# EasyEDA schematic Ranger_PCB.json

## Sheets
1 ESP32: TITLE: Sheet_1; REV: 1.0; Date: 2026-08-03; Sheet: 1/1; Company: Your Company
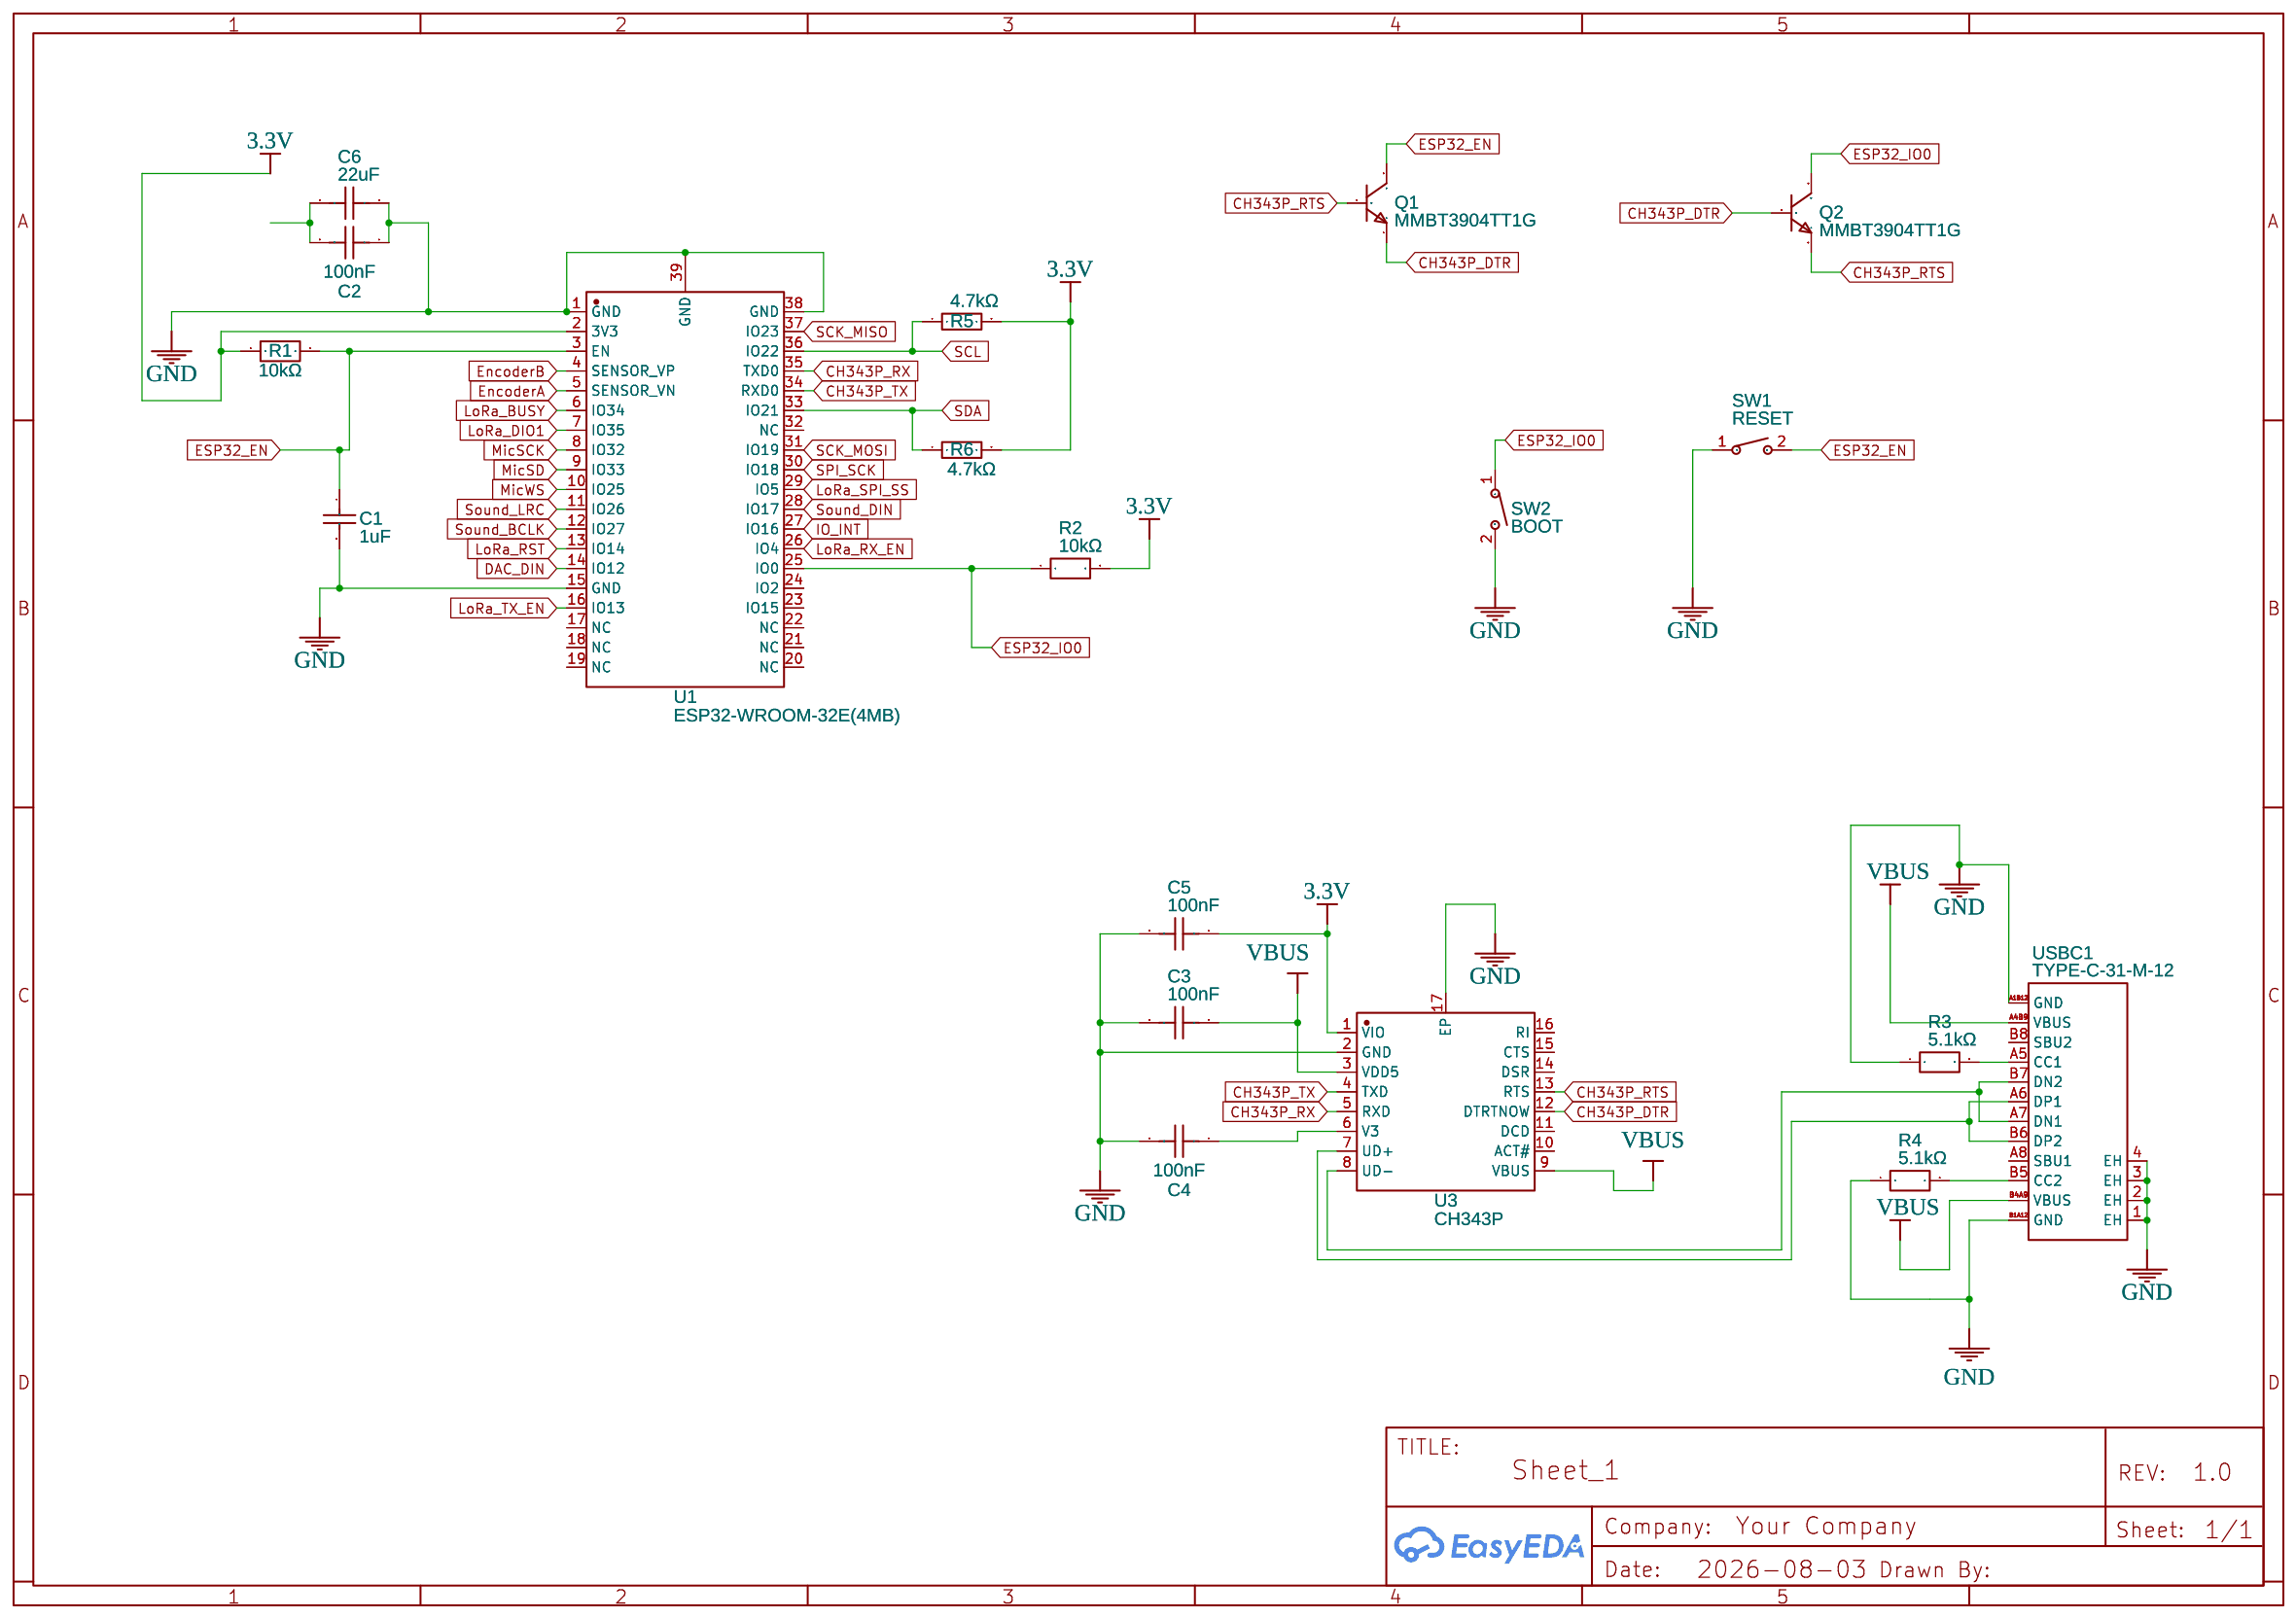
[diagram p0: ESP32]
2 LoRa: TITLE: Sheet_2; Drawn By: nadeesha12345678
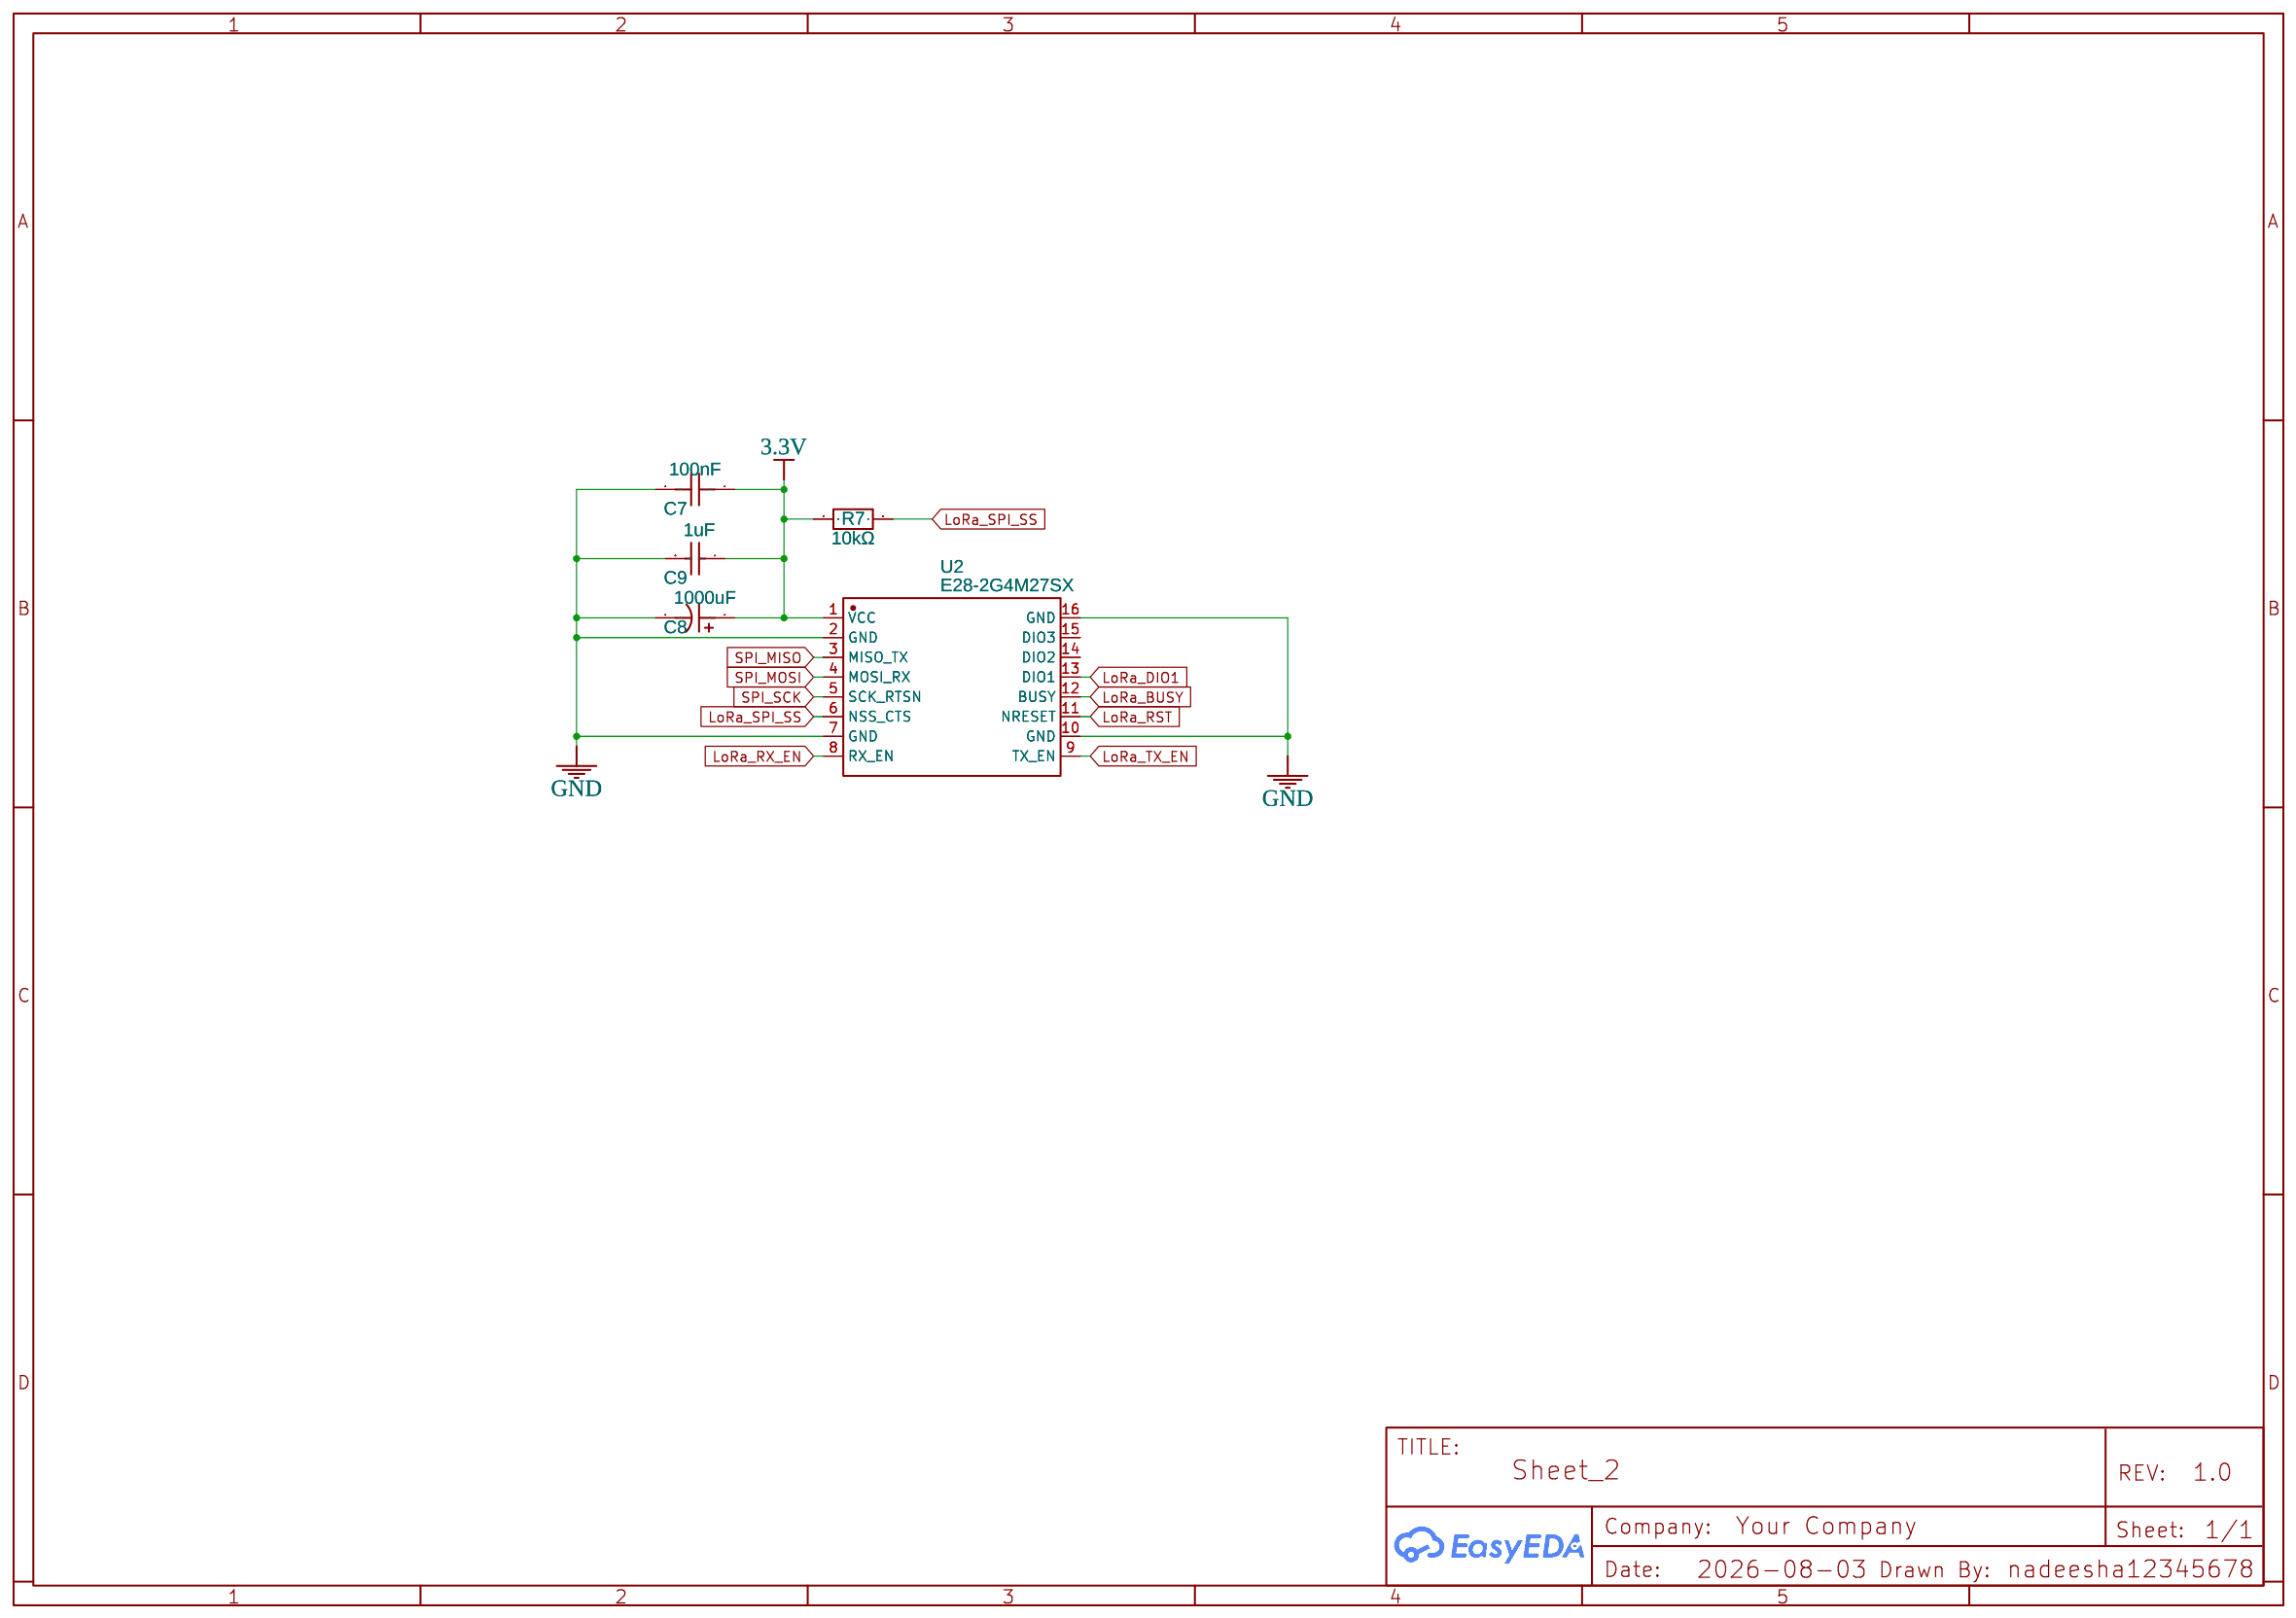
[diagram p1: LoRa]
3 Display, Buttons, LED: Drawn By: nadeesha12345678
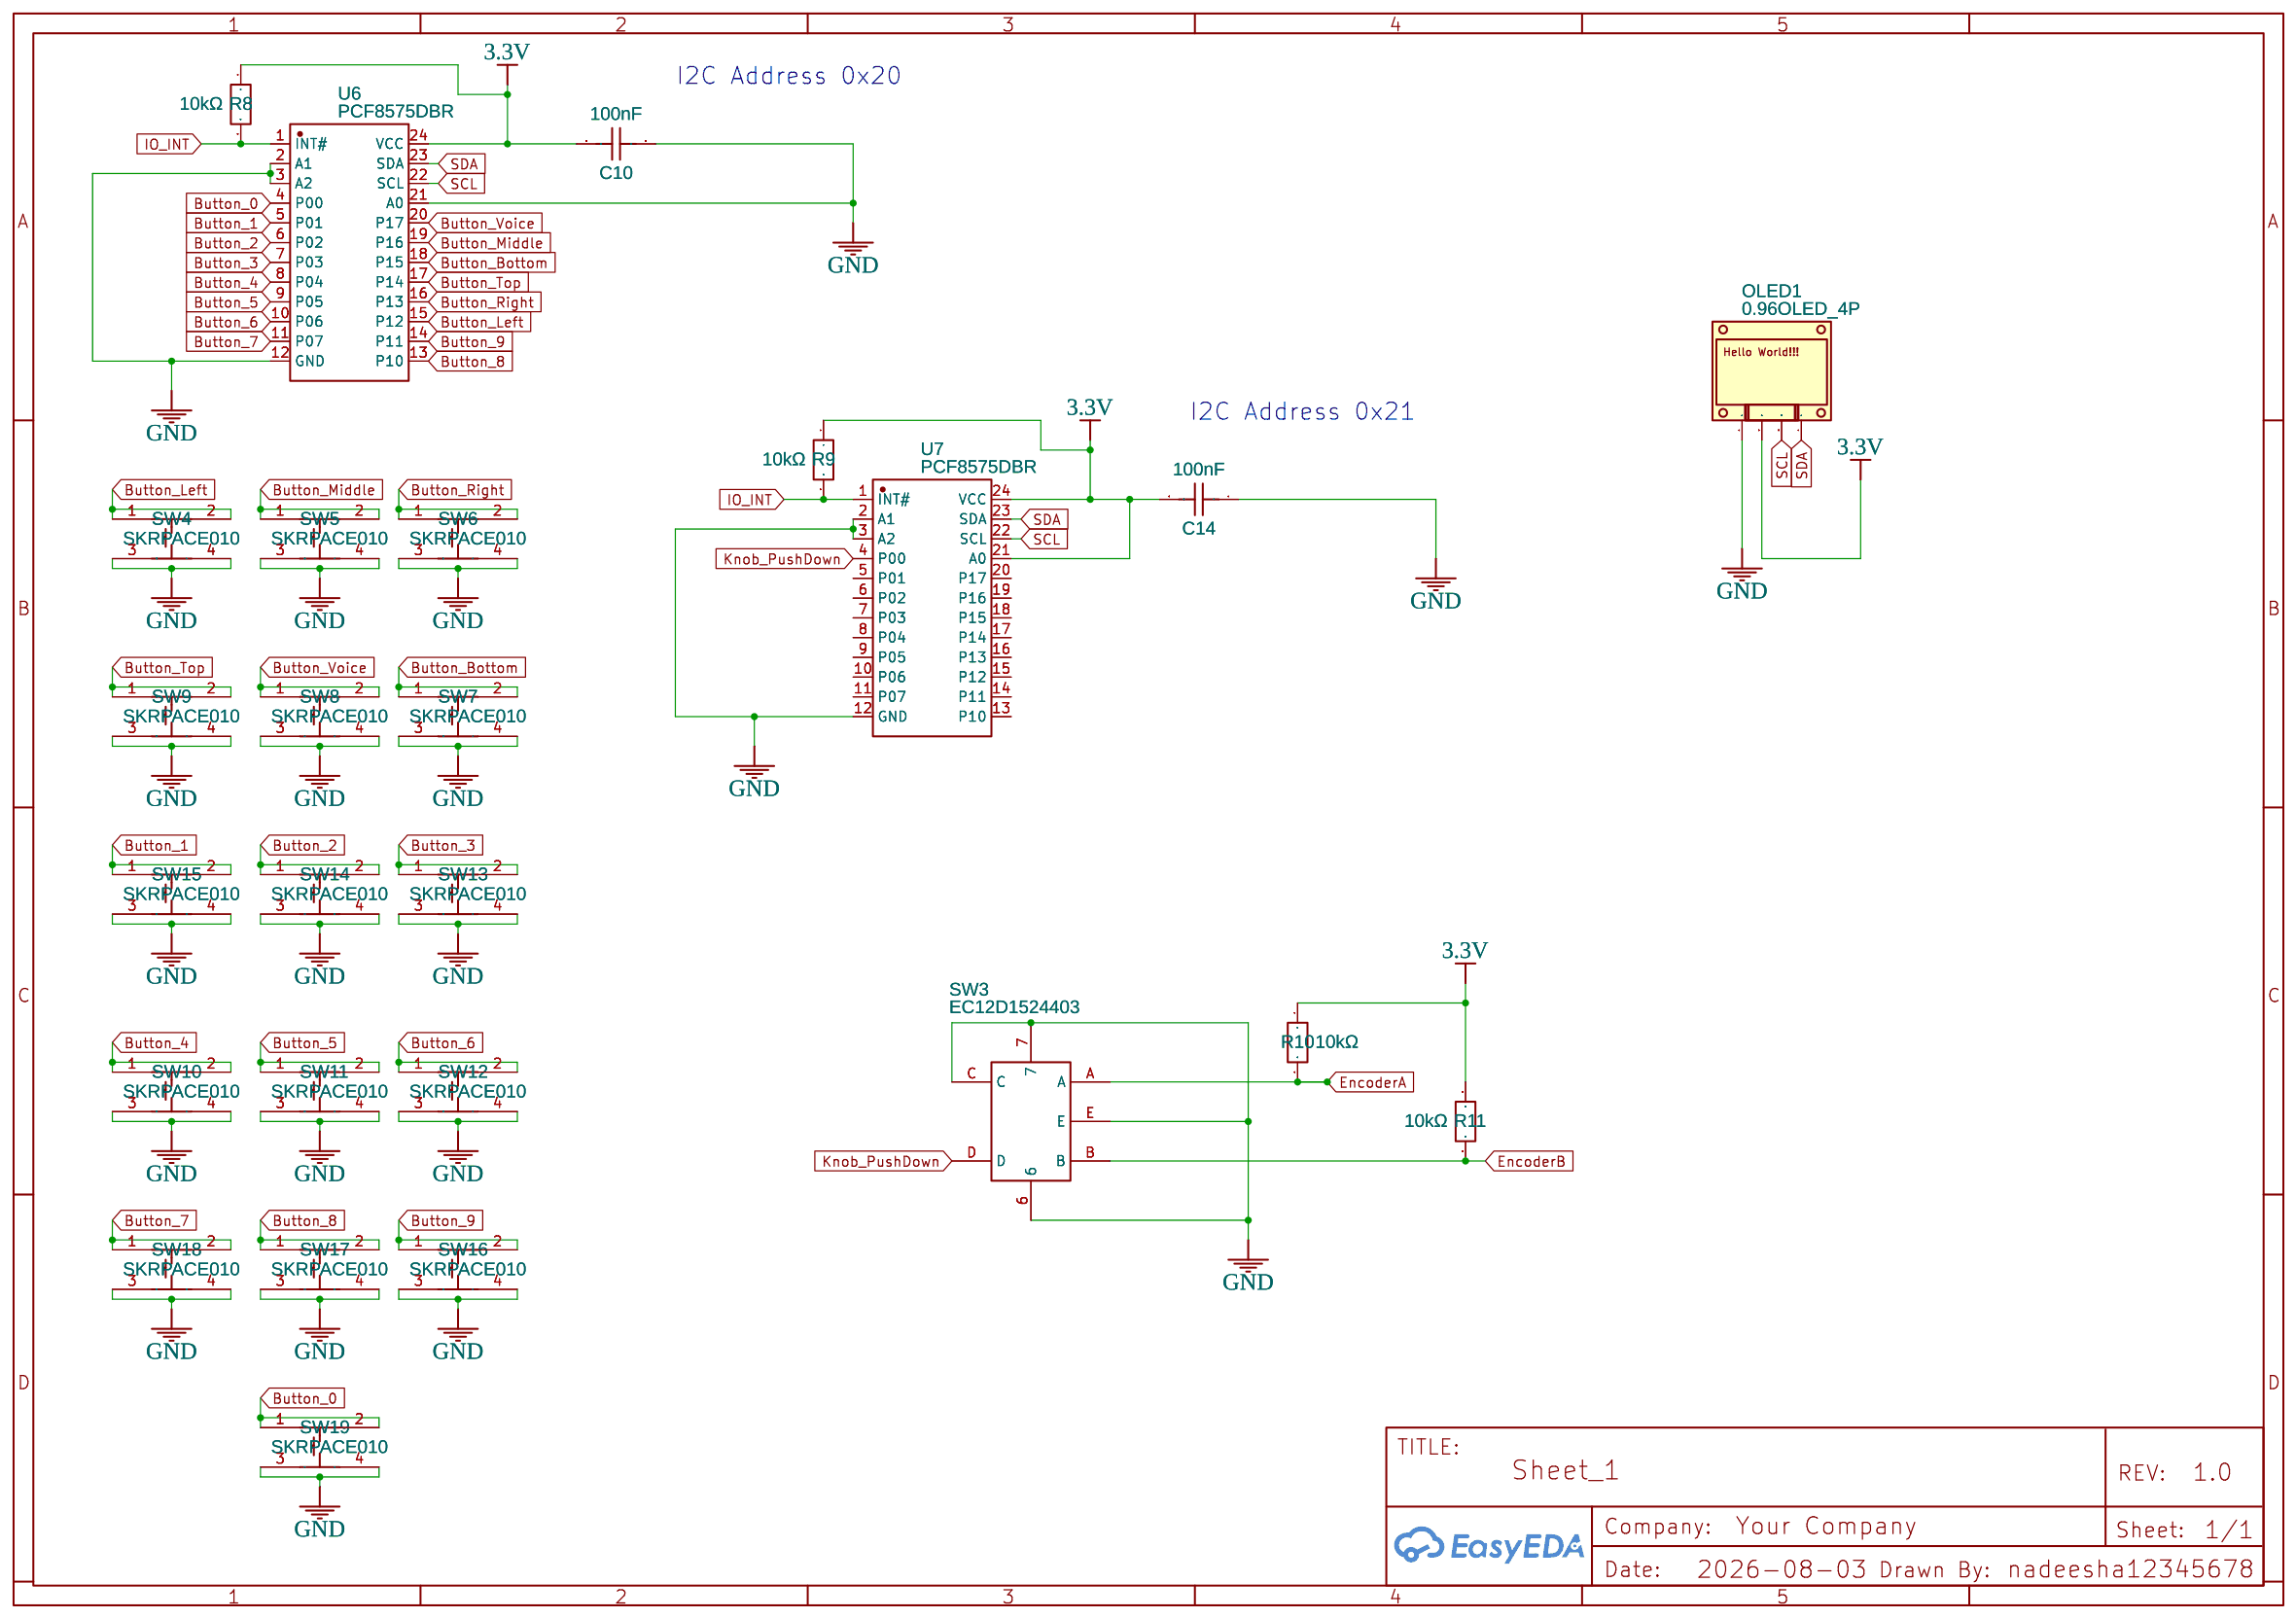
[diagram p2: Display, Buttons, LED]
4 Mic and Speaker: TITLE: Sheet_3; Drawn By: nadeesha12345678
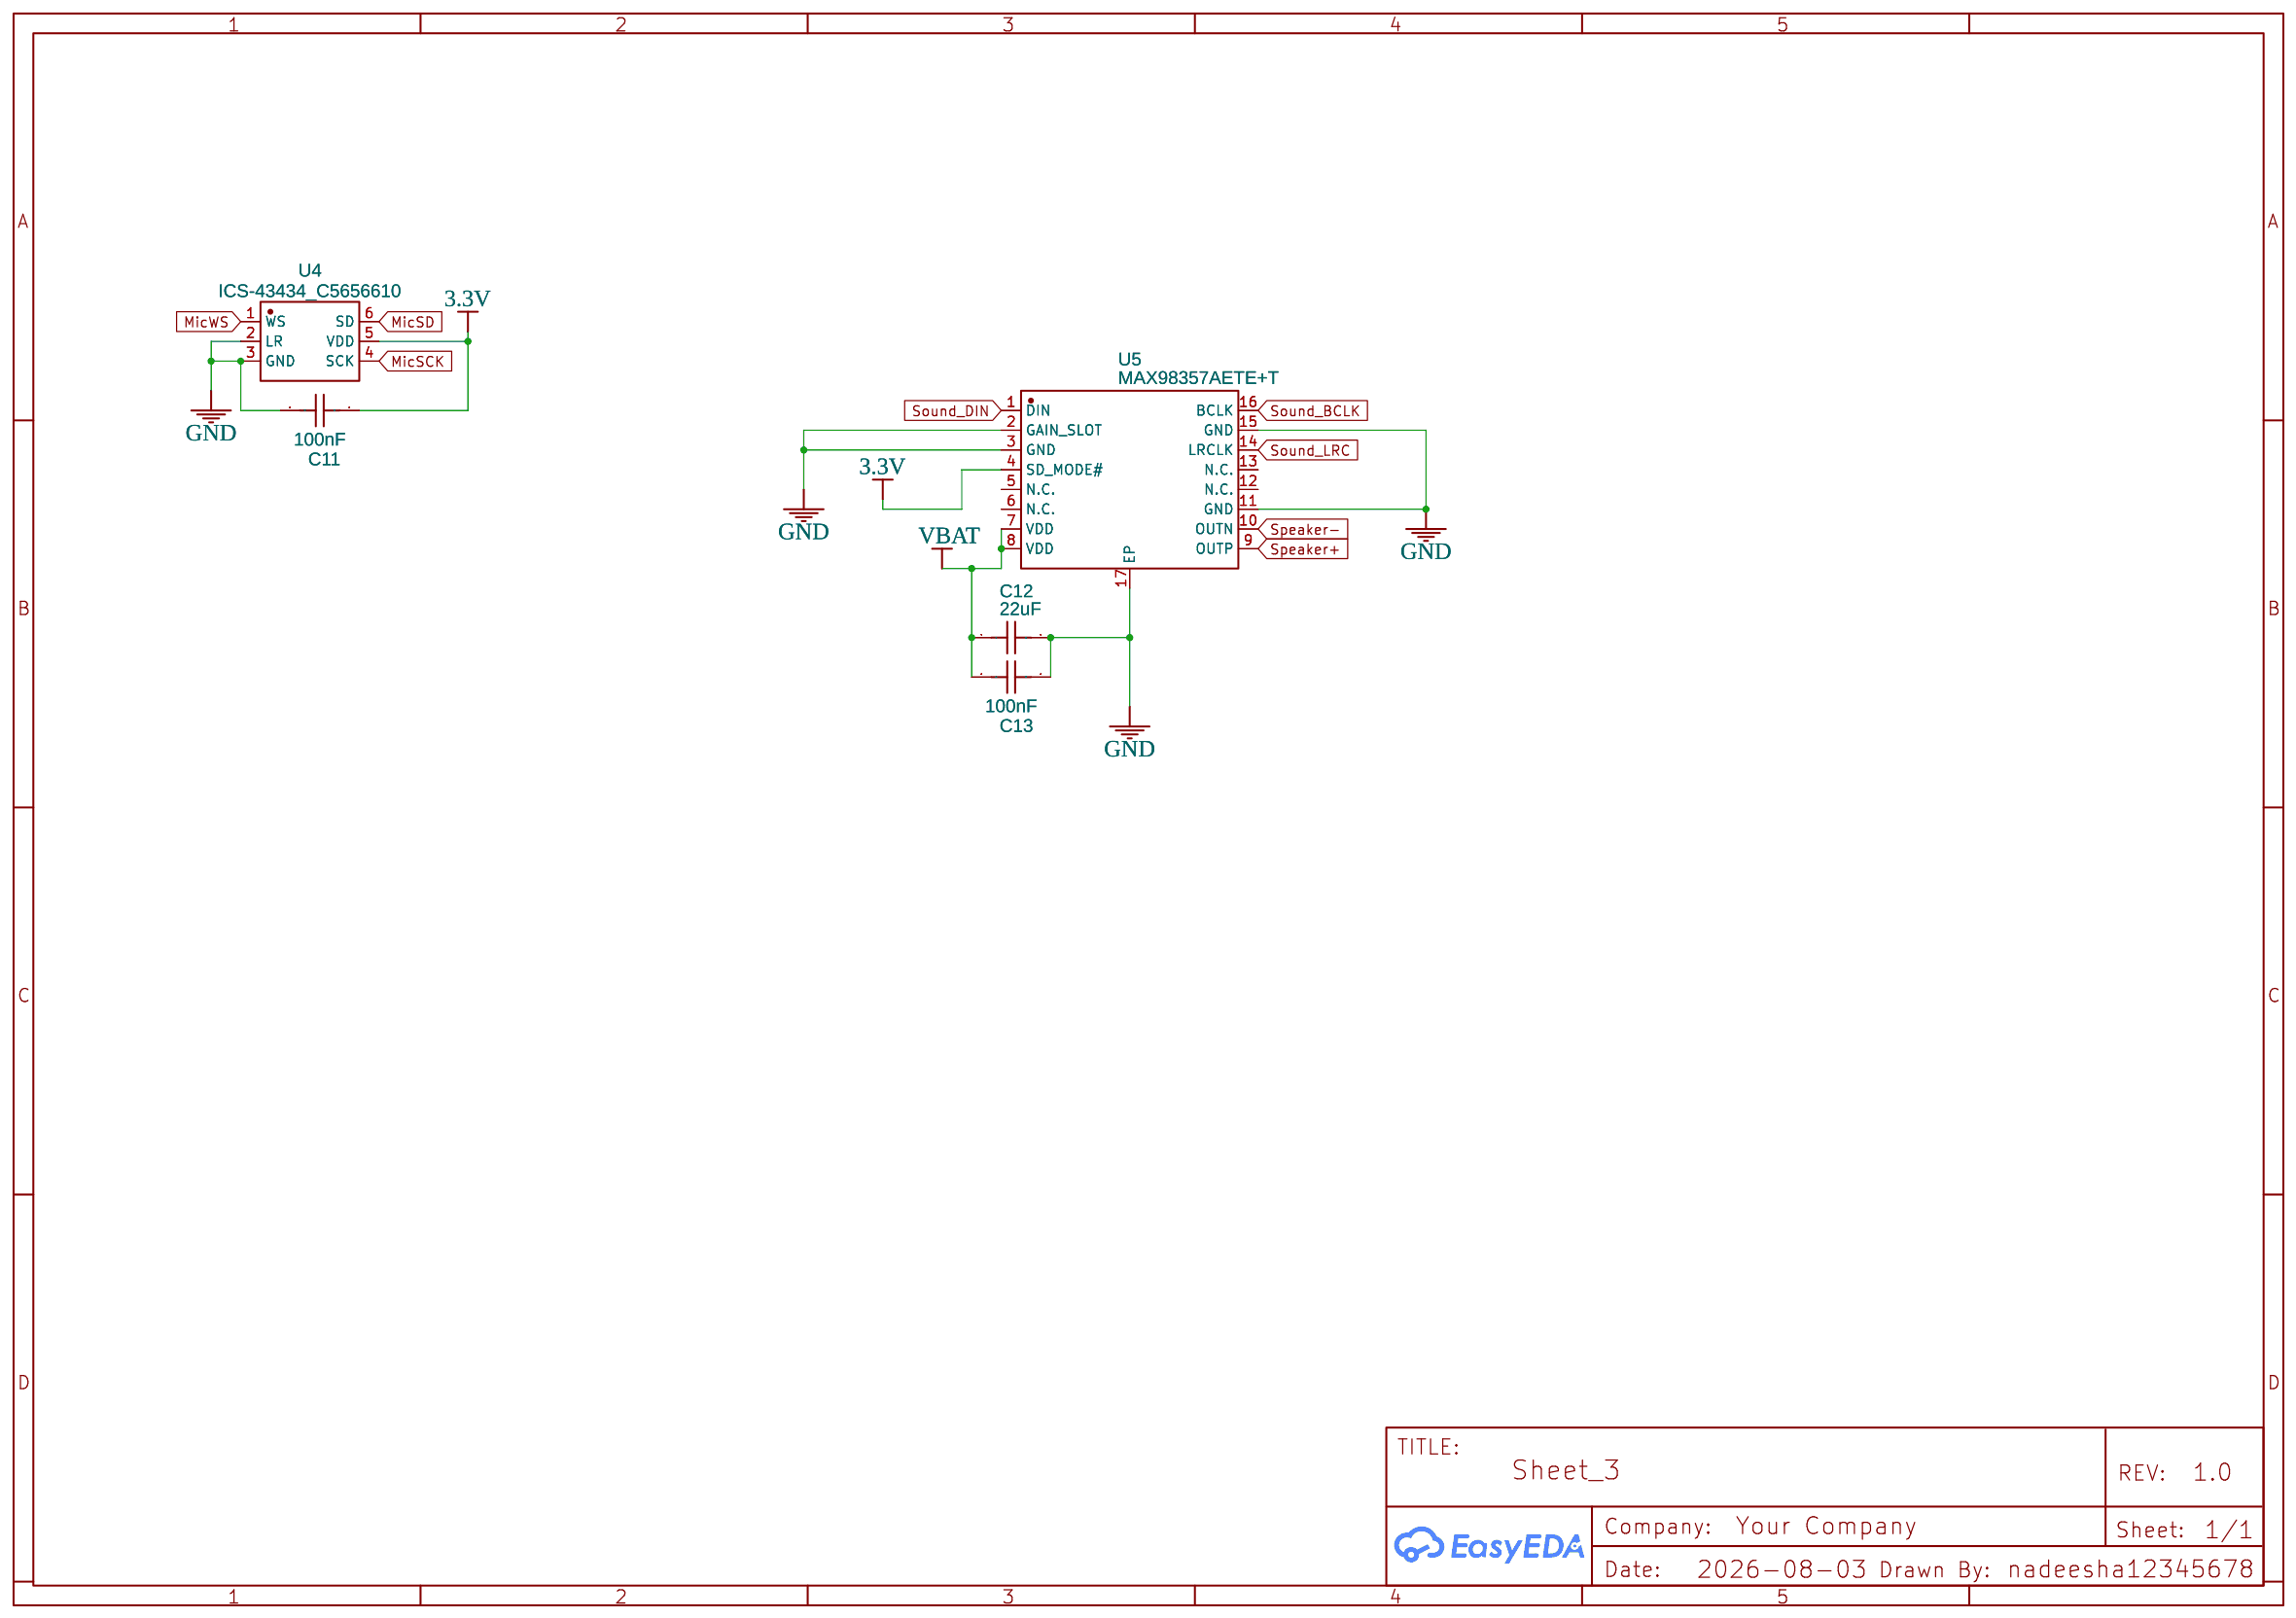
[diagram p3: Mic and Speaker]
5 Power: Drawn By: nadeesha12345678
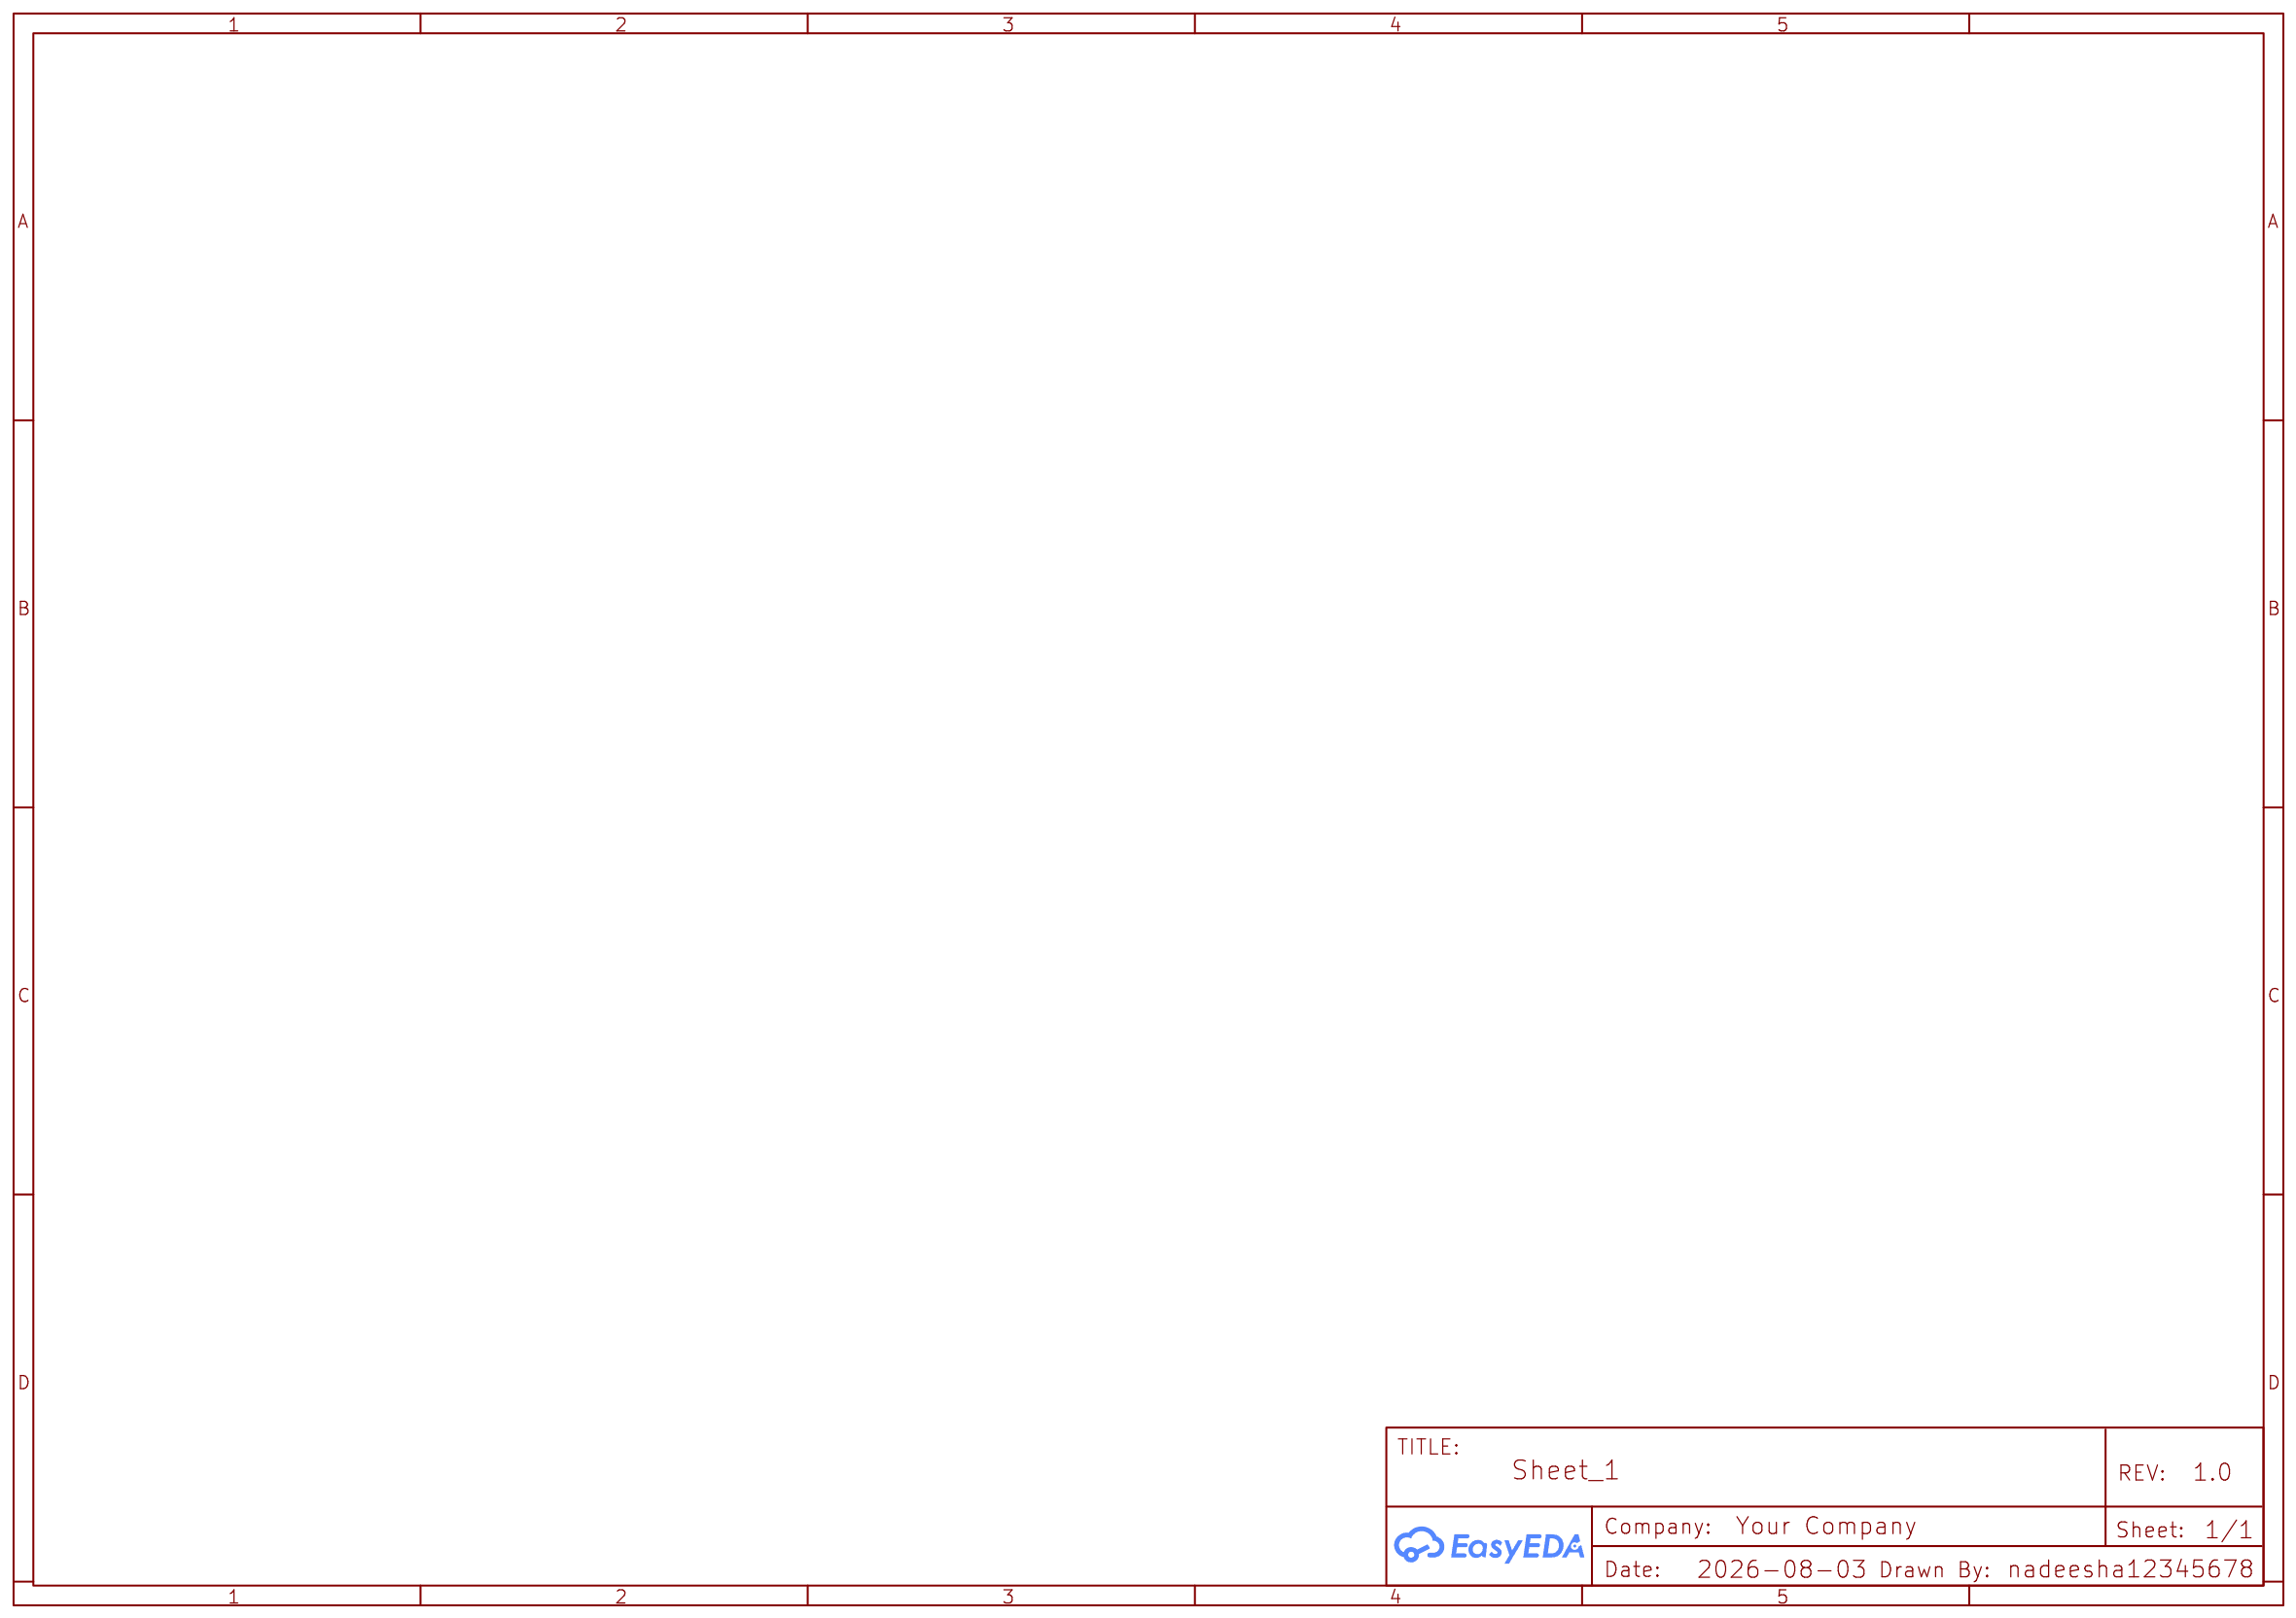
[diagram p4: Power]

## Parts
sheet Display, Buttons, LED
C10  100nF  [C0603]
C14  100nF  [C0603]
OLED1  0.96OLED_4P  [0.96OLED_4P]
R8  10kΩ  [R0603]
R9  10kΩ  [R0603]
R10  10kΩ  [R0603]
R11  10kΩ  [R0603]
SW3  EC12D1524403  [SW-TH_EC12D1524403]
SW4  SKRPACE010  [KEY-SMD_4P-L4.2-W3.2-P2.20-LS4.6]
SW5  SKRPACE010  [KEY-SMD_4P-L4.2-W3.2-P2.20-LS4.6]
SW6  SKRPACE010  [KEY-SMD_4P-L4.2-W3.2-P2.20-LS4.6]
SW7  SKRPACE010  [KEY-SMD_4P-L4.2-W3.2-P2.20-LS4.6]
SW8  SKRPACE010  [KEY-SMD_4P-L4.2-W3.2-P2.20-LS4.6]
SW9  SKRPACE010  [KEY-SMD_4P-L4.2-W3.2-P2.20-LS4.6]
SW10  SKRPACE010  [KEY-SMD_4P-L4.2-W3.2-P2.20-LS4.6]
SW11  SKRPACE010  [KEY-SMD_4P-L4.2-W3.2-P2.20-LS4.6]
SW12  SKRPACE010  [KEY-SMD_4P-L4.2-W3.2-P2.20-LS4.6]
SW13  SKRPACE010  [KEY-SMD_4P-L4.2-W3.2-P2.20-LS4.6]
SW14  SKRPACE010  [KEY-SMD_4P-L4.2-W3.2-P2.20-LS4.6]
SW15  SKRPACE010  [KEY-SMD_4P-L4.2-W3.2-P2.20-LS4.6]
SW16  SKRPACE010  [KEY-SMD_4P-L4.2-W3.2-P2.20-LS4.6]
SW17  SKRPACE010  [KEY-SMD_4P-L4.2-W3.2-P2.20-LS4.6]
SW18  SKRPACE010  [KEY-SMD_4P-L4.2-W3.2-P2.20-LS4.6]
SW19  SKRPACE010  [KEY-SMD_4P-L4.2-W3.2-P2.20-LS4.6]
U6  PCF8575DBR  [SSOP-24_L8.2-W5.3-P0.65-LS7.8-BL]
U7  PCF8575DBR  [SSOP-24_L8.2-W5.3-P0.65-LS7.8-BL]
sheet ESP32
C1  1uF  [C0603]
C2  100nF  [C0603]
C3  100nF  [C0603]
C4  100nF  [C0603]
C5  100nF  [C0603]
C6  22uF  [C0603]
Q1  MMBT3904TT1G  [SC-75-3_L1.6-W0.8-P1.00-LS1.6-BR]
Q2  MMBT3904TT1G  [SC-75-3_L1.6-W0.8-P1.00-LS1.6-BR]
R1  10kΩ  [R0603]
R2  10kΩ  [R0603]
R3  5.1kΩ  [R0603]
R4  5.1kΩ  [R0603]
R5  4.7kΩ  [R0603]
R6  4.7kΩ  [R0603]
SW1  RESET  [KEY-SMD_L4.0-W3.0-LS4.9-1]
SW2  BOOT  [KEY-SMD_L4.0-W3.0-LS4.9-1]
U1  ESP32-WROOM-32E(4MB)  [WIFI-SMD_ESP32-WROOM-32E]
U3  CH343P  [TQFN-16_L3.0-W3.0-P0.50-BL-EP1.7]
USBC1  TYPE-C-31-M-12  [USB-C_SMD-TYPE-C-31-M-12_1]
sheet LoRa
C7  100nF  [C0603]
C8  1000uF  [CAP-SMD_BD8.0-L8.3-W8.3-FD]
C9  1uF  [C0603]
R7  10kΩ  [R0603]
U2  E28-2G4M27SX  [WIRELM-SMD_E28-2G4M27SX]
sheet Mic and Speaker
C11  100nF  [C0603]
C12  22uF  [C0603]
C13  100nF  [C0603]
U4  ICS-43434_C5656610  [MIC-SMD_6P-L3.5-W2.7-P0.90-BL]
U5  MAX98357AETE+T  [TQFN-16_L3.0-W3.0-P0.50-BL-EP1.5]

## Library data of the parts
C2-C5 C7 C10 C11 C13 C14 = CL10B104KB8NNNC: Supplier: LCSC; Manufacturer: SAMSUNG(三星); Supplier Part: C1591; JLCPCB Part Class: Extended Part
OLED1 = 0.96OLED_4P: Supplier: LCSC; Contributor: LCEDA_Lib
R1 R2 R7-R11 = FRC0603F1002TS: Contributor: LCSC; Supplier: LCSC; Supplier Part: C2906982; Manufacturer: FOJAN(富捷); JLCPCB Part Class: Extended Part
SW3 = EC12D1524403: Supplier: LCSC; Manufacturer: ALPSALPINE(阿尔卑斯阿尔派); Supplier Part: C112349; JLCPCB Part Class: Extended Part
SW4-SW19 = SKRPACE010: Contributor: LCSC; Supplier: LCSC; Manufacturer: ALPSALPINE(阿尔卑斯阿尔派); Supplier Part: C139797; JLCPCB Part Class: Extended Part
U6 U7 = PCF8575DBR: Contributor: LCSC; Supplier: LCSC; Supplier Part: C2863388; Manufacturer: TI(德州仪器); JLCPCB Part Class: Extended Part
C1 C9 = CL10B105KA8NNNC: Supplier: LCSC; Manufacturer: SAMSUNG(三星); Supplier Part: C29936; JLCPCB Part Class: Extended Part
C6 C12 = CL10A226MP8NUNE: Supplier: LCSC; Manufacturer: SAMSUNG(三星); Supplier Part: C86295; JLCPCB Part Class: Extended Part
Q1 Q2 = MMBT3904TT1G: Contributor: LCSC; Supplier: LCSC; Supplier Part: C242260; Manufacturer: onsemi(安森美); JLCPCB Part Class: Extended Part
R3 R4 = FRC0603F5101TS: Contributor: lcsc; Supplier: LCSC; Supplier Part: C2907044; Manufacturer: FOJAN(富捷); JLCPCB Part Class: Extended Part
R5 R6 = RC0603FR-074K7L: Supplier: LCSC; Manufacturer: YAGEO(国巨); Supplier Part: C99782; JLCPCB Part Class: Extended Part
SW1 SW2 = HX 3X4X2-2P-1.6N TACTILE SWITCH: Supplier: LCSC; Supplier Part: C49234124; Manufacturer: hanxia(韩下); Manufacturer Part: HX 3x4x2-2P-1.6N TACTILE SWITCH; JLCPCB Part Class: Extended Part; Contributor: lcsc
U1 = ESP32-WROOM-32E(4MB): Contributor: LCSC; Supplier: LCSC; Supplier Part: C701341; Manufacturer: ESPRESSIF(乐鑫); Manufacturer Part: ESP32-WROOM-32E-N4; JLCPCB Part Class: Extended Part
U3 = CH343P: Contributor: LCSC; Supplier: LCSC; Supplier Part: C2846043; Manufacturer: WCH(南京沁恒); JLCPCB Part Class: Extended Part
USBC1 = TYPE-C-31-M-12: Contributor: LCSC; Supplier: LCSC; Supplier Part: C165948; Manufacturer: 韩国韩荣; JLCPCB Part Class: Extended Part
C8 = HV1A108M0810PZ: Supplier: LCSC; Supplier Part: C5246520; Manufacturer: HONOR(荣誉); Contributor: lcsc; JLCPCB Part Class: Extended Part
U2 = E28-2G4M27SX: Contributor: lcsc; Supplier: LCSC; Supplier Part: C5333988; Manufacturer: EBYTE(亿佰特)
U4 = ICS-43434_C5656610: Supplier: LCSC; Supplier Part: C5656610; Manufacturer: TDK InvenSense(应美盛); Manufacturer Part: ICS-43434; JLCPCB Part Class: Extended Part; Contributor: lcsc
U5 = MAX98357AETE+T: Contributor: LCSC; Supplier: LCSC; Supplier Part: C910544; Manufacturer: ADI(亚德诺)/MAXIM(美信); JLCPCB Part Class: Extended Part

## Nets
3.3V: C5.1 C7.1 C8.1 C9.1 C10.2 C11.1 C14.2 OLED1.2 R1.1 R2.2 R5.2 R6.2 R7.1 R8.1 R9.1 R10.1 R11.1 U1.2(3V3) U2.1(VCC) U3.1(VIO) U4.5(VDD) U5.4(SD_MODE#) U6.24(VCC) U7.21(A0) U7.24(VCC)
GND: C1.2 C2.1 C3.2 C4.2 C5.2 C6.2 C7.2 C8.2 C9.2 C10.1 C11.2 C12.2 C13.1 C14.1 OLED1.1 R3.1 R4.1 SW1.1 SW2.2 SW3.6 SW3.7 SW3.C SW3.E SW4.3 SW4.4 SW5.3 SW5.4 SW6.3 SW6.4 SW7.3 SW7.4 SW8.3 SW8.4 SW9.3 SW9.4 SW10.3 SW10.4 SW11.3 SW11.4 SW12.3 SW12.4 SW13.3 SW13.4 SW14.3 SW14.4 SW15.3 SW15.4 SW16.3 SW16.4 SW17.3 SW17.4 SW18.3 SW18.4 SW19.3 SW19.4 U1.1(GND) U1.15(GND) U1.38(GND) U1.39(GND) U2.2(GND) U2.7(GND) U2.10(GND) U2.16(GND) U3.2(GND) U3.17(EP) U4.2(LR) U4.3(GND) U5.2(GAIN_SLOT) U5.3(GND) U5.11(GND) U5.15(GND) U5.17(EP) U6.2(A1) U6.3(A2) U6.12(GND) U6.21(A0) U7.2(A1) U7.3(A2) U7.12(GND) USBC1.1(EH) USBC1.2(EH) USBC1.3(EH) USBC1.4(EH) USBC1.A1B12(GND) USBC1.B1A12(GND)
VBAT: C12.1 C13.2 U5.7(VDD) U5.8(VDD)
VBUS: C3.1 U3.3(VDD5) U3.9(VBUS) USBC1.A4B9(VBUS) USBC1.B4A9(VBUS)
Button_0: SW19.1 SW19.2 U6.4(P00)
Button_1: SW15.1 SW15.2 U6.5(P01)
Button_2: SW14.1 SW14.2 U6.6(P02)
Button_3: SW13.1 SW13.2 U6.7(P03)
Button_4: SW10.1 SW10.2 U6.8(P04)
Button_5: SW11.1 SW11.2 U6.9(P05)
Button_6: SW12.1 SW12.2 U6.10(P06)
Button_7: SW18.1 SW18.2 U6.11(P07)
Button_8: SW17.1 SW17.2 U6.13(P10)
Button_9: SW16.1 SW16.2 U6.14(P11)
Button_Bottom: SW7.1 SW7.2 U6.18(P15)
Button_Left: SW4.1 SW4.2 U6.15(P12)
Button_Middle: SW5.1 SW5.2 U6.19(P16)
Button_Right: SW6.1 SW6.2 U6.16(P13)
Button_Top: SW9.1 SW9.2 U6.17(P14)
Button_Voice: SW8.1 SW8.2 U6.20(P17)
CH343P_DTR: Q1.2(E) Q2.1(B) U3.12(DTRTNOW)
CH343P_RTS: Q1.1(B) Q2.2(E) U3.13(RTS)
CH343P_RX: U1.35(TXD0) U3.5(RXD)
CH343P_TX: U1.34(RXD0) U3.4(TXD)
DAC_DIN: U1.14(IO12)
EncoderA: R10.2 SW3.A U1.5(SENSOR_VN)
EncoderB: R11.2 SW3.B U1.4(SENSOR_VP)
ESP32_EN: C1.1 Q1.3(C) R1.2 SW1.2 U1.3(EN)
ESP32_IO0: Q2.3(C) R2.1 SW2.1 U1.25(IO0)
IO_INT: R8.2 R9.2 U1.27(IO16) U6.1(INT#) U7.1(INT#)
Knob_PushDown: SW3.D U7.4(P00)
LoRa_BUSY: U1.6(IO34) U2.12(BUSY)
LoRa_DIO1: U1.7(IO35) U2.13(DIO1)
LoRa_RST: U1.13(IO14) U2.11(NRESET)
LoRa_RX_EN: U1.26(IO4) U2.8(RX_EN)
LoRa_SPI_SS: R7.2 U1.29(IO5) U2.6(NSS_CTS)
LoRa_TX_EN: U1.16(IO13) U2.9(TX_EN)
MicSCK: U1.8(IO32) U4.4(SCK)
MicSD: U1.9(IO33) U4.6(SD)
MicWS: U1.10(IO25) U4.1(WS)
SCK_MISO: U1.37(IO23)
SCK_MOSI: U1.31(IO19)
SCL: OLED1.3 R5.1 U1.36(IO22) U6.22(SCL) U7.22(SCL)
SDA: OLED1.4 R6.1 U1.33(IO21) U6.23(SDA) U7.23(SDA)
Sound_BCLK: U1.12(IO27) U5.16(BCLK)
Sound_DIN: U1.28(IO17) U5.1(DIN)
Sound_LRC: U1.11(IO26) U5.14(LRCLK)
Speaker+: U5.9(OUTP)
Speaker-: U5.10(OUTN)
SPI_MISO: U2.3(MISO_TX)
SPI_MOSI: U2.4(MOSI_RX)
SPI_SCK: U1.30(IO18) U2.5(SCK_RTSN)
Net-(C2-2): C2.2 C6.1
Net-(C4-1): C4.1 U3.6(V3)
Net-(R3-2): R3.2 USBC1.A5(CC1)
Net-(R4-2): R4.2 USBC1.B5(CC2)
Net-(U3-7): U3.7(UD+) USBC1.A6(DP1) USBC1.B6(DP2)
Net-(U3-8): U3.8(UD-) USBC1.A7(DN1) USBC1.B7(DN2)

Not connected (* = marked no-connect by the designer): U1 17(NC) 18(NC) 19(NC) 20(NC) 21(NC) 22(NC) 23(IO15) 24(IO2) 32(NC); U2 14(DIO2) 15(DIO3); U3 10(ACT#) 11(DCD) 14(DSR) 15(CTS) 16(RI); U5 5(N.C.) 6(N.C.) 12(N.C.) 13(N.C.); U7 5(P01) 6(P02) 7(P03) 8(P04) 9(P05) 10(P06) 11(P07) 13(P10) 14(P11) 15(P12) 16(P13) 17(P14) 18(P15) 19(P16) 20(P17); USBC1 A8(SBU1) B8(SBU2)

## Notes on the sheets
sheet 3
- I2C Address 0x20
- I2C Address 0x21
